# EAGLE design Petra (EAGLE 7.7.0)
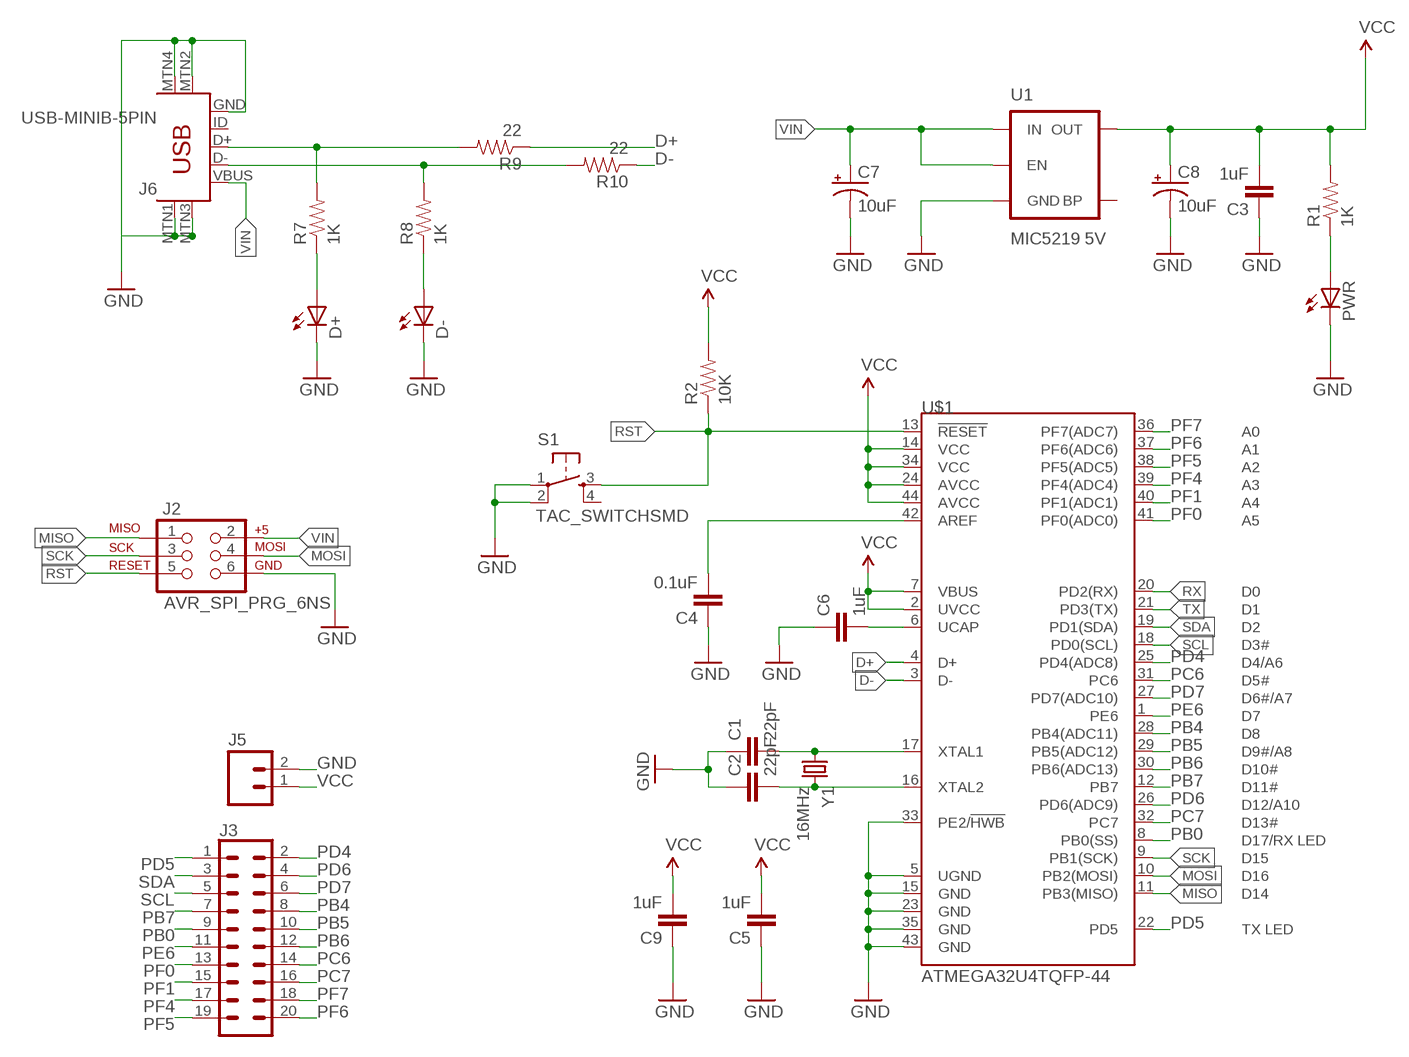
[diagram p0: schematic, sheet 1]

## Parts
C1  22pF  CAP0402-CAP  [0402-CAP]
C2  22pF  CAP0402-CAP  [0402-CAP]
C3  1uF  CAP0402-CAP  [0402-CAP]
C4  0.1uF  CAP0402-CAP  [0402-CAP]
C5  1uF  CAP0402-CAP  [0402-CAP]
C6  1uF  CAP0402-CAP  [0402-CAP]
C7  10uF  CAP_POL1206  [EIA3216]
C8  10uF  CAP_POL1206  [EIA3216]
C9  1uF  CAP0402-CAP  [0402-CAP]
D+  LEDCHIP-LED0805  [CHIP-LED0805]
D-  LEDCHIP-LED0805  [CHIP-LED0805]
J2  AVR_SPI_PRG_6NS  [2X3-NS]
J3  CONN_10X2  [2X10]
J5  M02PTH  [1X02]
J6  USB-MINIB-5PIN  [USB-MINIB]
PWR  LEDCHIP-LED0805  [CHIP-LED0805]
R1  1K  10KOHM-1/10W-1%(0603)0603  [0603-RES]
R2  10K  10KOHM-1/10W-1%(0603)0603  [0603-RES]
R7  1K  10KOHM-1/10W-1%(0603)0603  [0603-RES]
R8  1K  10KOHM-1/10W-1%(0603)0603  [0603-RES]
R9  22  10KOHM-1/10W-1%(0603)0603  [0603-RES]
R10  22  10KOHM-1/10W-1%(0603)0603  [0603-RES]
S1  TAC_SWITCHSMD  TACTILE-SWITCH-PTH  [TAC-SWITCH-PTH]
U1  MIC5219 5V  V_REG_MIC52195V  [SOT23-5]
U$1  ATMEGA32U4TQFP-44  [TQFP44]
Y1  16MHz  CRYSTALCRYSTAL-SMD-5X3-16MHZ  [CRYSTAL-SMD-5X3]

## Nets
D+: R9.1 U$1.4(D+)
D-: R10.1 U$1.3(D-)
GND: C1.1 C2.1 C3.1 C4.1 C5.1 C6.1 C7.C(-) C8.C(-) C9.1 D+.C D-.C J2.6 J5.2 J6.GND J6.MTN1(MTN2) J6.MTN2(MTN3) J6.MTN3(MTN1) J6.MTN4 PWR.C S1.1 S1.2 U1.2(GND) U$1.5(UGND) U$1.15(GND) U$1.23(GND) U$1.33(PE2/!HWB) U$1.35(GND) U$1.43(GND)
MISO: J2.1 U$1.11(PB3(MISO))
MOSI: J2.4 U$1.10(PB2(MOSI))
N$1: C1.2 U$1.17(XTAL1) Y1.1
N$2: C2.2 U$1.16(XTAL2) Y1.3
N$3: C6.2 U$1.6(UCAP)
N$4: C4.2 U$1.42(AREF)
N$7: PWR.A R1.1
N$27: D-.A R8.1
N$28: D+.A R7.1
N$29: J6.D+ R7.2 R9.2
N$30: J6.D- R8.2 R10.2
PB0: J3.9 U$1.8(PB0(SS))
PB4: J3.8 U$1.28(PB4(ADC11))
PB5: J3.10 U$1.29(PB5(ADC12))
PB6: J3.12 U$1.30(PB6(ADC13))
PB7: J3.7 U$1.12(PB7)
PC6: J3.14 U$1.31(PC6)
PC7: J3.16 U$1.32(PC7)
PD4: J3.2 U$1.25(PD4(ADC8))
PD5: J3.1 U$1.22(PD5)
PD6: J3.4 U$1.26(PD6(ADC9))
PD7: J3.6 U$1.27(PD7(ADC10))
PE6: J3.11 U$1.1(PE6)
PF0: J3.13 U$1.41(PF0(ADC0))
PF1: J3.15 U$1.40(PF1(ADC1))
PF4: J3.17 U$1.39(PF4(ADC4))
PF5: J3.19 U$1.38(PF5(ADC5))
PF6: J3.20 U$1.37(PF6(ADC6))
PF7: J3.18 U$1.36(PF7(ADC7))
RST: J2.5 R2.1 S1.3 U$1.13(!RESET)
RX: U$1.20(PD2(RX))
SCK: J2.3 U$1.9(PB1(SCK))
SCL: J3.5 U$1.18(PD0(SCL))
SDA: J3.3 U$1.19(PD1(SDA))
TX: U$1.21(PD3(TX))
VCC: C3.2 C5.2 C8.A(+) C9.2 J5.1 R1.2 R2.2 U1.5(OUT) U$1.2(UVCC) U$1.7(VBUS) U$1.14(VCC) U$1.24(AVCC) U$1.34(VCC) U$1.44(AVCC)
VIN: C7.A(+) J2.2 J6.VBUS U1.1(IN) U1.3(EN)
Unconnected: J6.ID S1.4 U1.4(BP)

## Library data of the parts
C1-C6 C9 = SparkFun-Passives:CAP: Capacitor Standard 0603 ceramic capacitor, and 0.1" leaded capacitor.
C7 C8 = SparkFun-Passives:CAP_POL: Capacitor Polarized These are standard SMD and PTH capacitors. Normally 10uF, 47uF, and 100uF in electrolytic and tantalum varieties. Always verify the external diameter of the through hole cap, it varies with capacity, voltage, and manufacturer. The EIA devices should be standard.
D+ D- PWR = led:LED: LED OSRAM: - CHIPLED LG R971, LG N971, LY N971, LG Q971, LY Q971, LO R971, LY R971 LH N974, LH R974 LS Q976, LO Q976, LY Q976 LO Q996 - Hyper CHIPLED LW Q18S LB Q993, LB Q99A, LB R99A - SideLED LS A670, LO A670, LY A670, LG A670, LP A670 LB A673, LV A673, LT A673, LW A673 LH A674 LY A675 LS A676, LA A676, LO A676, LY A676, LW A676 LS A679, LY A679, LG A679 - Hyper Micro SIDELED® LS Y876, LA Y876, LO Y876, LY Y876 LT Y87S - SmartLED LW L88C, LW L88S LB L89C, LB L89S, LG L890 LS L89K, LO L89K, LY L89K LS L896, LA L896, LO L896, LY L896 - TOPLED LS T670, LO T670, LY T670, LG T670, LP T670 LSG T670, LSP T670, LSY T670, LOP T670, LYG T670 LG T671, LOG T671, LSG T671 LB T673, LV T673, LT T673, LW T673 LH T674 LS T676, LA T676, LO T676, LY T676, LB T676, LH T676, LSB T676, LW T676 LB T67C, LV T67C, LT T67C, LS T67K, LO T67K, LY T67K, LW E67C LS E67B, LA E67B, LO E67B, LY E67B, LB E67C, LV E67C, LT E67C LW T67C LS T679, LY T679, LG T679 LS T770, LO T770, LY T770, LG T770, LP T770 LB T773, LV T773, LT T773, LW T773 LH T774 LS E675, LA E675, LY E675, LS T675 LS T776, LA T776, LO T776, LY T776, LB T776 LHGB T686 LT T68C, LB T68C - Hyper Mini TOPLED® LB M676 - Mini TOPLED Santana® LG M470 LS M47K, LO M47K, LY M47K Source: http://www.osram.convergy.de LUXEON: - LUMILED® LXK2-PW12-R00, LXK2-PW12-S00, LXK2-PW14-U00, LXK2-PW14-V00 LXK2-PM12-R00, LXK2-PM12-S00, LXK2-PM14-U00 LXK2-PE12-Q00, LXK2-PE12-R00, LXK2-PE12-S00, LXK2-PE14-T00, LXK2-PE14-U00 LXK2-PB12-K00, LXK2-PB12-L00, LXK2-PB12-M00, LXK2-PB14-N00, LXK2-PB14-P00, LXK2-PB14-Q00 LXK2-PR12-L00, LXK2-PR12-M00, LXK2-PR14-Q00, LXK2-PR14-R00 LXK2-PD12-Q00, LXK2-PD12-R00, LXK2-PD12-S00 LXK2-PH12-R00, LXK2-PH12-S00 LXK2-PL12-P00, LXK2-PL12-Q00, LXK2-PL12-R00 Source: www.luxeon.com KINGBRIGHT: KA-3528ASYC Source: www.kingbright.com
J2 = SparkFun-Connectors:AVR_SPI_PRG_6: AVR ISP 6 Pin This is the reduced ISP connector for AVR programming. Common on Arduino. This footprint will take up less PCB space and can be used with a 10-pin to 6-pin adapter such as SKU: BOB-08508 **Special note about "TEST_POINT" package. The stop mask is on the top side, so if you want your programming test points to be on the bottom of your board, make sure to place this package on the bottom side of the board. This also ensure that the orientation to program from the bottom side will be correct.
J3 = SparkFun-Connectors:CONN_10X2: Multi connection point. Often used as Generic Header-pin footprint for 0.1 inch spaced/style header connections On any of the 0.1 inch spaced packages, you can populate with these: Break Away Headers - Straight <https://www.sparkfun.com/products/116> (PRT-00116) Break Away Male Headers - Right Angle <https://www.sparkfun.com/products/553> (PRT-00553) Female Headers <https://www.sparkfun.com/products/115> (PRT-00115) Break Away Headers - Machine Pin <https://www.sparkfun.com/products/117> (PRT-00117) Break Away Female Headers - Swiss Machine Pin <https://www.sparkfun.com/products/743> (PRT-00743) Special note about the "SPECIAL" package: This was SPECIALLY designed to be used with our Graphic LCD Backpack. Be sure you want to use this! It is not only staggered on each line of header holes, but IT IS ALSO offset of the center point of the top and bottom lines by 5 mil. This causes the headers to lock into place on the "standard" footprint on the LCD screen. The extra squares on the tdocu layer are there simply to reference other pins (if you were to actually populate a longer header than ten long - this is what we do with the backpacks).
J5 = SparkFun-Connectors:M02: Standard 2-pin 0.1" header. Use with - straight break away headers ( PRT-00116) - right angle break away headers (PRT-00553) - swiss pins (PRT-00743) - machine pins (PRT-00117) - female headers (PRT-00115) Molex polarized connector foot print use with: PRT-08233 with associated crimp pins and housings. 2.54_SCREWTERM for use with PRT-10571. 3.5mm Screw Terminal footprints for PRT-08084 5mm Screw Terminal footprints for use with PRT-08432
J6 = SparkFun-Connectors:USB-MINIB: Mini-USB "B" connector with 5th pin broken out. Created new symbol breaking out 5th "ID" pin in mini/micro USB connector spec. See: http://en.wikipedia.org/wiki/Mini_usb#Cables. Uses same footprint as 4-pin symbol. Also added pins to connect to mounting / shield pads if required (probably not generally needed as signals aren't shielded once they leave the connector).; PROD_ID: CONN-08193
R1 R7-R10 = SparkFun-Resistors:10KOHM-1/10W-1%(0603): RES-00824; PROD_ID: RES-00824; VALUE: 10K
R2 = SparkFun-Resistors:10KOHM-1/10W-1%(0603): RES-00824; PROD_ID: RES-00824
S1 = GeekAmmo:TACTILE-SWITCH: Tactile Switch 4 Pins, SPST NO
U1 = SparkFun-PowerIC:V_REG_MIC5219: V_REG MIC5219 Standard 3.3V and 5V 500mA LDO voltage regulator in SOT-23 layout. Micrel part MIC5219. BP (by-pass) pin is used to lower output noise with 470pF cap, may be left open.; PROD_ID: VREG-10107
U$1 = SparkFun-DigitalIC:ATMEGA32U4: Atmel 44-pin 8-bit Microcontroller with 32KBytes of ISP Flash and USB Controller
Y1 = SparkFun-FreqCtrl:CRYSTAL: Various standard crystals. Proven footprints.; PROD_ID: XTAL-08218

## Net classes
0 default: width 0.254 mm, drill 0.356 mm, clearance 0.254 mm

## Board
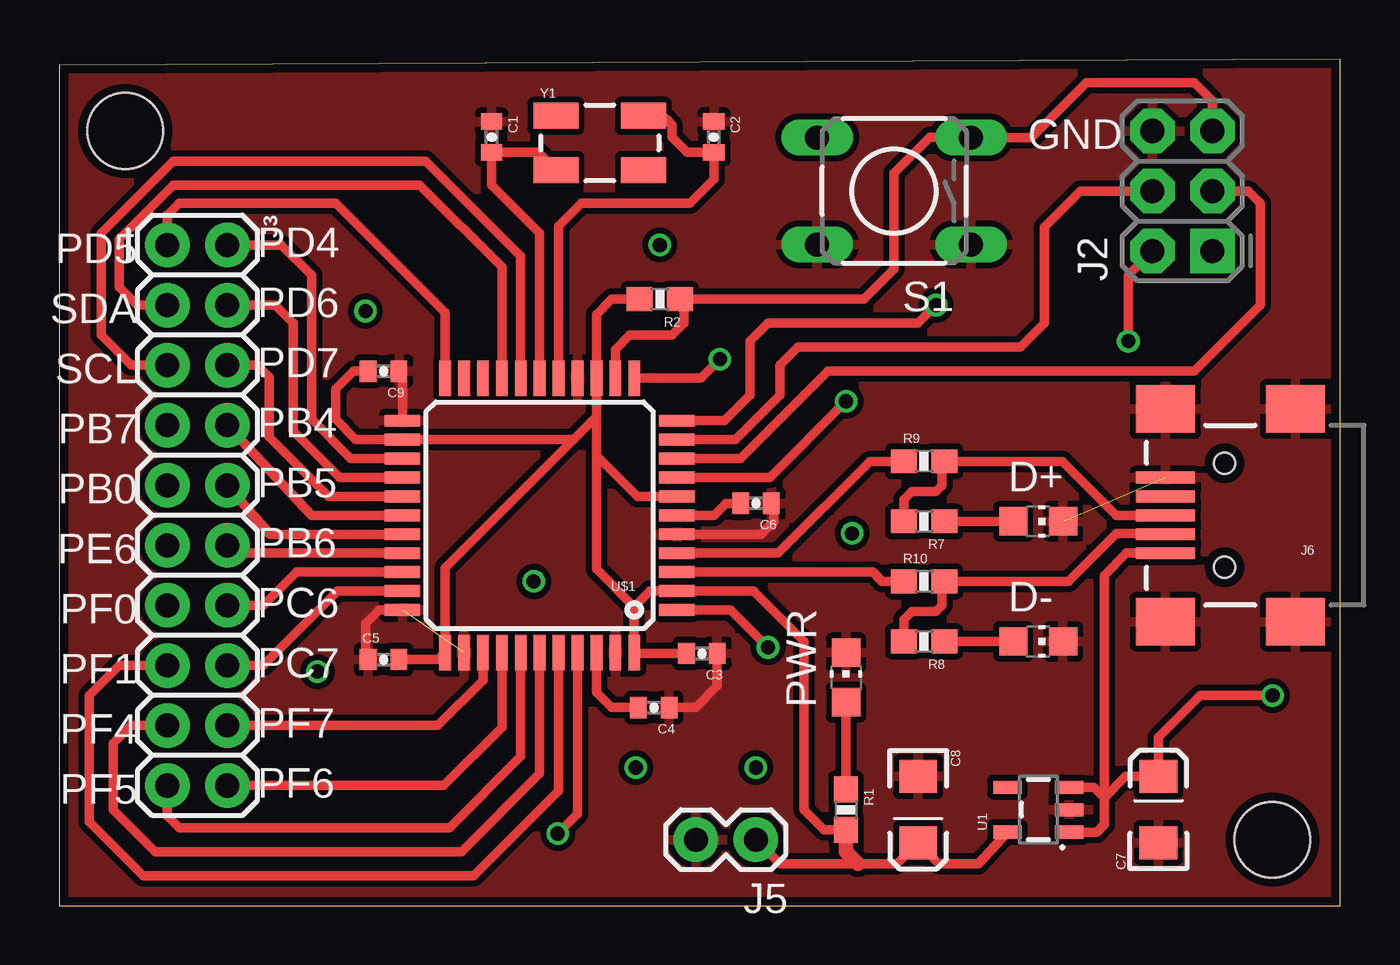
[diagram p1: board, top side]
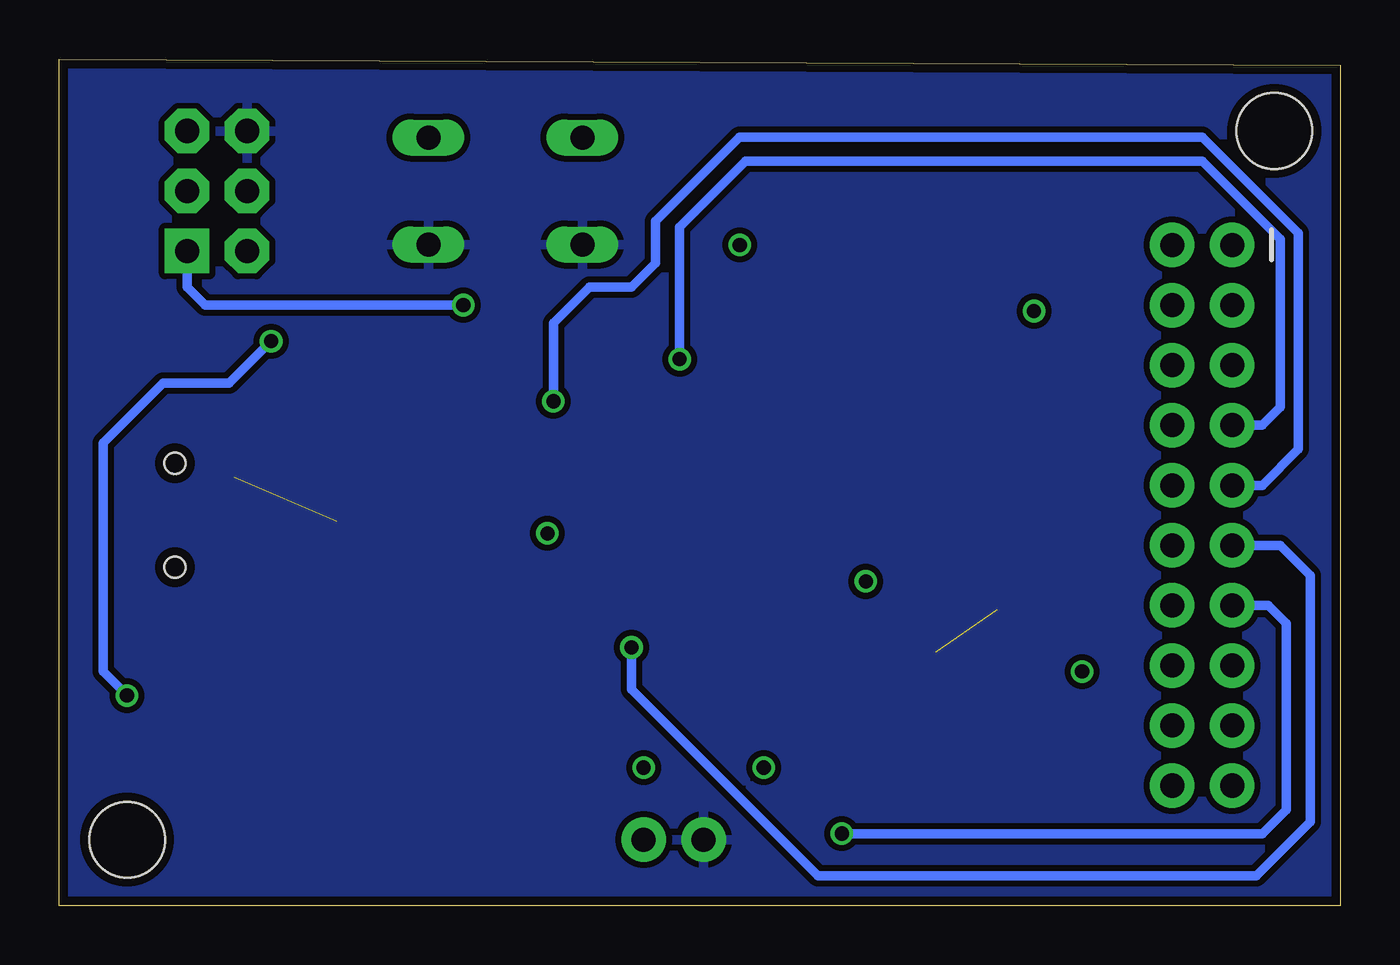
[diagram p2: board, bottom side, seen from below]

Size 54.18 x 35.8 mm. Coordinates in mm from the lower left corner, seen from the top.
Outline: 0,0 54.18,0 54.18,35.8 0,35.55 0,0
Copper layers (1*16): Top 0.0356mm / dielectric 1.5011mm / Bottom 0.0356mm
Design rules "oshpark-2layer": minimum track width 6mil, minimum drill 13mil, track to track 6mil, track to pad 6mil, pad to pad 6mil, via to via 6mil, smd to smd 6mil, copper to edge 15mil, drill to drill 6mil, minimum pad ring 7mil, minimum via ring 7mil, stop-mask expansion 2.5mil, vias tented up to drill 0mil, thermal gap 10mil
Holes 3.2 mm at 2.79,32.77 51.31,2.79

### Footprints (pad centres in the part's own frame; a part is rotated, then mirrored left to right if it is on the bottom)
0402-CAP = smd 0.7 x 0.9: 1 -0.65,0; 2 0.65,0
EIA3216 = smd 1.4 x 1.6: A 1.4,0; C -1.4,0
CHIP-LED0805 = smd 1.2 x 1.2: A 0,-1.05; C 0,1.05
2X3-NS = drill 1.016 pad 1.88 square: 1 -2.54,-1.27 | drill 1.016 pad 1.88 octagon: 2 -2.54,1.27; 3 0,-1.27; 4 0,1.27; 5 2.54,-1.27; 6 2.54,1.27
2X10 = drill 1.016 pad 1.88: 1 0,0; 2 0,2.54; 3 2.54,0; 4 2.54,2.54; 5 5.08,0; 6 5.08,2.54; 7 7.62,0; 8 7.62,2.54; 9 10.16,0; 10 10.16,2.54; 11 12.7,0; 12 12.7,2.54; 13 15.24,0; 14 15.24,2.54; 15 17.78,0; 16 17.78,2.54; 17 20.32,0; 18 20.32,2.54; 19 22.86,0; 20 22.86,2.54
1X02 = drill 1.016 pad 1.88: 1 0,0; 2 2.54,0
USB-MINIB = smd 2.5 x 0.5: D+ 2.5,0; D- 2.5,0.8; GND 2.5,-1.6; ID 2.5,-0.8; VBUS 2.5,1.6 | smd 2.5 x 2: MTN1 -3,4.5; MTN2 2.5,4.5; MTN3 -3,-4.5; MTN4 2.5,-4.5 | hole 0.9: 0,2.2; 0,-2.2
0603-RES = smd 1.1 x 1: 1 -0.85,0; 2 0.85,0
TAC-SWITCH-PTH = drill 1.016 pad 1.524 long: 1 -3.251,2.261; 2 3.251,2.261; 3 -3.251,-2.261; 4 3.251,-2.261
SOT23-5 = smd 0.55 x 1.2: 1 -0.95,-1.3; 2 0,-1.3; 3 0.95,-1.3; 4 0.95,1.3; 5 -0.95,1.3
TQFP44 = smd 1.5 x 0.5: 1 -5.8,4; 2 -5.8,3.2; 3 -5.8,2.4; 4 -5.8,1.6; 5 -5.8,0.8; 6 -5.8,0; 7 -5.8,-0.8; 8 -5.8,-1.6; 9 -5.8,-2.4; 10 -5.8,-3.2; 11 -5.8,-4; 23 5.8,-4; 24 5.8,-3.2; 25 5.8,-2.4; 26 5.8,-1.6; 27 5.8,-0.8; 28 5.8,0; 29 5.8,0.8; 30 5.8,1.6; 31 5.8,2.4; 32 5.8,3.2; 33 5.8,4 | smd 0.5 x 1.5: 12 -4,-5.8; 13 -3.2,-5.8; 14 -2.4,-5.8; 15 -1.6,-5.8; 16 -0.8,-5.8; 17 0,-5.8; 18 0.8,-5.8; 19 1.6,-5.8; 20 2.4,-5.8; 21 3.2,-5.8; 22 4,-5.8; 34 4,5.8; 35 3.2,5.8; 36 2.4,5.8; 37 1.6,5.8; 38 0.8,5.8; 39 0,5.8; 40 -0.8,5.8; 41 -1.6,5.8; 42 -2.4,5.8; 43 -3.2,5.8; 44 -4,5.8
CRYSTAL-SMD-5X3 = smd 1.9 x 1.1: 1 -1.85,-1.15; 2 1.85,-1.15; 3 1.85,1.15; 4 -1.85,1.15

### Placement (x,y rotation side)
C1  18.29,32.51 270 top
C2  27.69,32.51 270 top
C3  27.18,10.67 180 top
C4  25.15,8.38 180 top
C5  13.72,10.41 0 top
C6  29.46,17.02 180 top
C7  46.48,4.06 90 top
C8  36.32,4.06 270 top
C9  13.72,22.61 180 top
D+  41.4,16.26 270 top
D-  41.4,11.18 270 top
J2  47.5,30.23 90 top
J3  4.57,27.94 270 top
J5  29.46,2.79 180 top
J6  49.28,16.51 180 top
PWR  33.27,9.65 0 top
R1  33.27,4.06 270 top
R2  25.4,25.65 180 top
R7  36.58,16.26 180 top
R8  36.58,11.18 180 top
R9  36.58,18.8 0 top
R10  36.58,13.72 0 top
S1  35.31,30.23 180 top
U1  41.4,4.06 90 top
U$1  20.32,16.51 180 top
Y1  22.86,32.26 0 top

### Tracks (layer width: path | path; a pad name or v marks a point on that pad's centre or on a via)
D+
  Top 0.406: U$1.4 30.4,14.91 34.29,18.8 R9.1
D-
  Top 0.406: U$1.3 34.4,14.11 34.8,13.72 R10.1
GND  (2 unrouted)
  Top 0.406: U$1.33 13.53,12.51 12.95,11.94 12.95,10.53 C5.1 | C3.1 27.83,9.29 26.92,8.38 C4.1 | U$1.5 29.68,15.71 30.23,16.26 30.23,16.91 C6.1 | C9.1 14.52,22.45 U$1.23
  pour Top: 0.25,35.31 53.85,35.31 53.85,0.51 0.51,0.51
  pour Bottom: 0.25,35.31 53.85,35.31 53.85,0.51 0.51,0.51
MISO  (via drill 0.6)
  Top 0.406: U$1.11 28.13,20.51 29.21,21.59 29.21,23.88 29.97,24.64 36.32,24.64 v37.08,25.4
  Bottom 0.406: v37.08,25.4 48.01,25.4 48.77,26.16 J2.1
MOSI
  Top 0.406: U$1.10 28.6,19.71 30.48,21.59 30.48,22.86 31.24,23.62 40.64,23.62 41.66,24.64 41.66,28.7 43.18,30.23 J2.4
N$1
  Top 0.406: Y1.1 20.26,31.86 C1.2 18.29,30.48 20.32,28.45 U$1.17
N$2
  Top 0.406: 24.96,33.16 Y1.3 24.84,33.27 25.65,33.27 25.91,33.02 25.91,32.51 26.56,31.86 C2.2 27.69,30.73 26.67,29.72 22.1,29.72 21.12,28.74 U$1.16
N$3
  Top 0.406: U$1.6 27.69,16.51 28.19,17.02 C6.2
N$4
  Top 0.406: U$1.42 22.72,9.03 23.37,8.38 C4.2
N$5  (via drill 0.6)
  other vias: 33.53,15.75
N$7
  Top 0.406: PWR.A R1.1
N$8  (via drill 0.6)
  other vias: 24.38,5.84
N$12  (via drill 0.6)
  other vias: 20.07,13.72
N$15  (via drill 0.6)
  other vias: 12.95,25.15
N$17  (via drill 0.6)
  other vias: 29.46,5.84
N$19  (via drill 0.6)
  other vias: 10.92,9.91
N$23  (via drill 0.6)
  other vias: 25.4,27.94
N$27
  Top 0.406: R8.1 D-.A
N$28
  Top 0.406: R7.1 D+.A
N$29
  Top 0.406: J6.D+ 44.7,16.51 42.42,18.8 R9.2 37.34,18.71 37.34,17.78 37.08,17.53 36.07,17.53 35.73,17.18 R7.2
N$30
  Top 0.406: J6.D- 46.74,15.75 44.7,15.75 42.67,13.72 R10.2 37.34,13.63 37.34,12.7 37.08,12.45 36.07,12.45 35.73,12.1 R8.2
PB0  (via drill 0.6)
  Top 0.406: U$1.8 30.05,18.11 v33.27,21.34
  Bottom 0.406: J3.9 3.3,17.78 1.78,19.3 1.78,28.45 5.84,32.51 25.4,32.51 28.96,28.96 28.96,27.18 29.97,26.16 31.75,26.16 33.27,24.64 v33.27,21.34
PB4
  Top 0.406: U$1.28 10.67,16.51 J3.8
PB5
  Top 0.406: U$1.29 8.93,15.71 J3.10
PB6
  Top 0.406: U$1.30 7.44,14.91 J3.12
PB7  (via drill 0.6)
  Top 0.406: U$1.12 27.14,22.31 v27.94,23.11
  Bottom 0.406: v27.94,23.11 27.94,28.7 25.15,31.5 5.84,31.5 2.54,28.19 2.54,21.08 3.3,20.32 J3.7
PC6
  Top 0.406: U$1.31 10.05,14.11 8.64,12.7 J3.14
PC7
  Top 0.406: U$1.32 11.79,13.31 8.64,10.16 J3.16
PD4
  Top 0.406: U$1.25 12.33,18.91 10.67,20.57 10.67,26.67 9.4,27.94 J3.2
PD5
  Top 0.406: U$1.22 16.32,25.08 11.68,29.72 5.08,29.72 4.57,29.21 J3.1
PD6
  Top 0.406: U$1.26 11.86,18.11 9.91,20.07 9.91,24.64 9.14,25.4 J3.4
PD7
  Top 0.406: U$1.27 11.39,17.31 8.89,19.81 8.89,22.35 8.38,22.86 J3.6
PE6  (via drill 0.6)
  Top 0.406: U$1.1 28.38,12.51 v29.97,10.92
  Bottom 0.406: v29.97,10.92 29.97,9.14 22.1,1.27 3.56,1.27 1.27,3.56 1.27,13.97 2.54,15.24 J3.11
PF0  (via drill 0.6)
  Top 0.406: U$1.41 21.92,3.89 v21.08,3.05
  Bottom 0.406: v21.08,3.05 3.3,3.05 2.29,4.06 2.29,11.94 3.05,12.7 J3.13
PF1
  Top 0.406: U$1.40 21.12,4.86 17.53,1.27 3.56,1.27 1.27,3.56 1.27,8.89 2.54,10.16 J3.15
PF4
  Top 0.406: U$1.39 20.32,5.59 17.02,2.29 4.06,2.29 2.29,4.06 2.29,6.86 3.05,7.62 J3.17
PF5
  Top 0.406: U$1.38 19.52,6.31 16.51,3.3 5.08,3.3 4.57,3.81 J3.19
PF6
  Top 0.406: U$1.37 18.72,7.54 16.26,5.08 J3.20
PF7
  Top 0.406: U$1.36 17.92,9.54 16,7.62 J3.18
RST
  Top 0.406: U$1.13 23.52,23.52 24.13,24.13 25.91,24.13 26.42,24.64 26.42,25.49 R2.1 34.04,25.65 35.31,26.92 35.31,30.99 36.83,32.51 38.53,32.51 S1.3 41.12,32.49 43.43,34.8 48.01,34.8 48.77,34.04 J2.5
SCK
  Top 0.406: U$1.9 28.82,18.91 32.51,22.61 48.01,22.61 50.8,25.4 50.8,29.72 50.29,30.23 J2.3
SCL
  Top 0.406: U$1.18 19.52,27.47 15.49,31.5 4.83,31.5 1.78,28.45 1.78,24.13 3.05,22.86 J3.5
SDA
  Top 0.406: U$1.19 18.72,27 15.24,30.48 4.83,30.48 2.54,28.19 2.54,26.16 3.3,25.4 J3.3
VCC
  Top 0.406: C3.2 24.36,10.67 U$1.44 24.32,12.64 | C5.2 16.02,10.41 U$1.34 16.32,14.29 21.74,19.71 | 22.72,20.69 U$1.14 22.72,25.01 23.37,25.65 R2.2 | 21.74,19.71 22.72,20.69 | 24.32,12.64 24.99,13.31 U$1.2 29.36,13.31 31.5,11.18 31.5,4.06 32.35,3.21 R1.2 | 22.72,20.69 22.72,19.05 | 22.72,19.05 22.72,14.24 24.32,12.64 | U$1.7 24.46,17.31 22.72,19.05 | 21.74,19.71 U$1.24 12.55,19.71 11.68,20.57 11.68,21.84 12.45,22.61 C9.2 | U1.5 38.86,1.78 37.21,1.78 C8.A 35.44,1.78 33.78,1.78 30.48,1.78 J5.1
  Top 0.61: R1.2 33.27,2.29 33.78,1.78
VIN  (via drill 0.6)
  Top 0.406: U1.1 43.88,3.11 44.2,3.43 44.2,4.32 44.2,4.57 | U1.3 43.75,5.01 44.2,4.57 | J2.2 45.21,26.67 v45.21,23.88 | v51.31,8.89 48.26,8.89 46.48,7.11 C7.A 45.09,5.46 44.2,4.57 | J6.VBUS 45.14,14.91 44.2,13.97 44.2,4.57
  Bottom 0.406: v45.21,23.88 46.99,22.1 49.78,22.1 52.32,19.56 52.32,9.91 v51.31,8.89

### Text on the board
tPlace: GND | PD5 | PD4 | SDA | PD6 | SCL | PD7 | PB7 | PB4 | PB0 | PB5 | PE6 | VIN | PB6 | VCC | PF0 | PC6 | PF1 | TX | PC7 | RX | PF4 | PF7 | PF5 | PF6